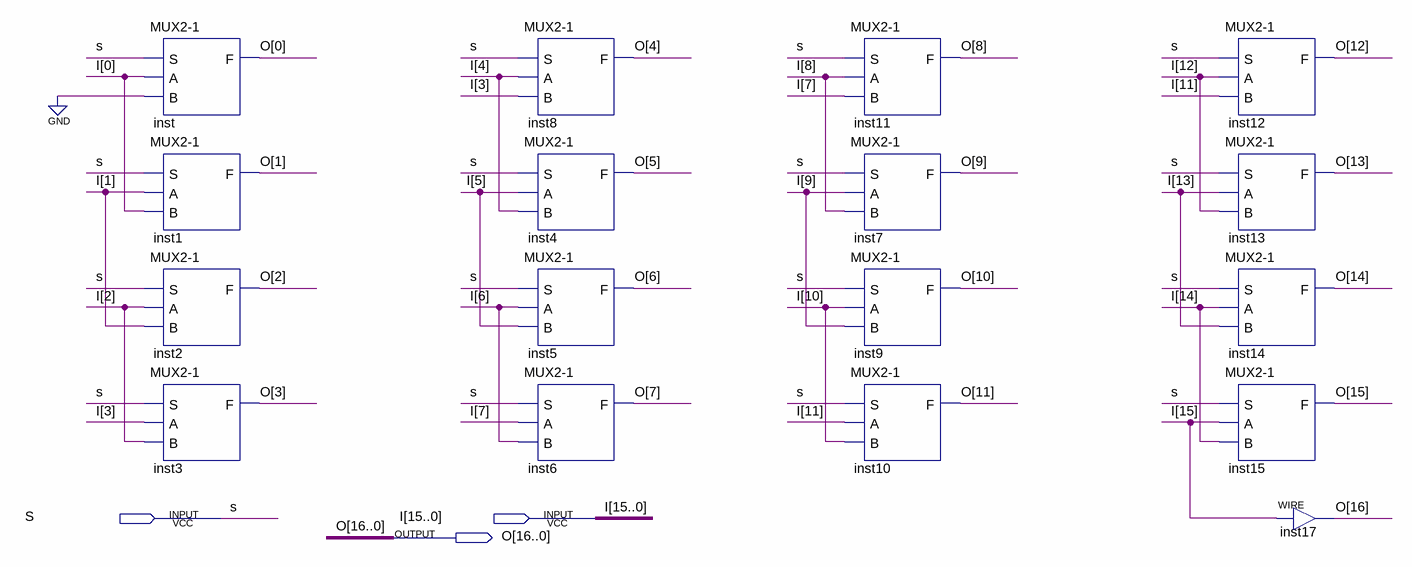
[diagram p0: schematic sheet]
// Quartus schematic shifter17bit.bdf as structural Verilog: 17 symbols, 3 pins
module shifter17bit (
  input  S,
  input  [15:0] I,
  output [16:0] O
);

  \MUX2-1  inst (.S(S), .A(I[0]), .B(1'b0), .F(O[0]));
  \MUX2-1  inst1 (.S(S), .A(I[1]), .B(I[0]), .F(O[1]));
  \MUX2-1  inst2 (.S(S), .A(I[2]), .B(I[1]), .F(O[2]));
  \MUX2-1  inst3 (.S(S), .A(I[3]), .B(I[2]), .F(O[3]));
  \MUX2-1  inst8 (.S(S), .A(I[4]), .B(I[3]), .F(O[4]));
  \MUX2-1  inst4 (.S(S), .A(I[5]), .B(I[4]), .F(O[5]));
  \MUX2-1  inst5 (.S(S), .A(I[6]), .B(I[5]), .F(O[6]));
  \MUX2-1  inst6 (.S(S), .A(I[7]), .B(I[6]), .F(O[7]));
  \MUX2-1  inst11 (.S(S), .A(I[8]), .B(I[7]), .F(O[8]));
  \MUX2-1  inst7 (.S(S), .A(I[9]), .B(I[8]), .F(O[9]));
  \MUX2-1  inst9 (.S(S), .A(I[10]), .B(I[9]), .F(O[10]));
  \MUX2-1  inst10 (.S(S), .A(I[11]), .B(I[10]), .F(O[11]));
  \MUX2-1  inst12 (.S(S), .A(I[12]), .B(I[11]), .F(O[12]));
  \MUX2-1  inst13 (.S(S), .A(I[13]), .B(I[12]), .F(O[13]));
  \MUX2-1  inst14 (.S(S), .A(I[14]), .B(I[13]), .F(O[14]));
  \MUX2-1  inst15 (.S(S), .A(I[15]), .B(I[14]), .F(O[15]));
  assign O[16] = I[15];  // WIRE inst17
endmodule
